# EAGLE design STorM32 NT imu v21 mini-mpu9250 (EAGLE 7.5.0)
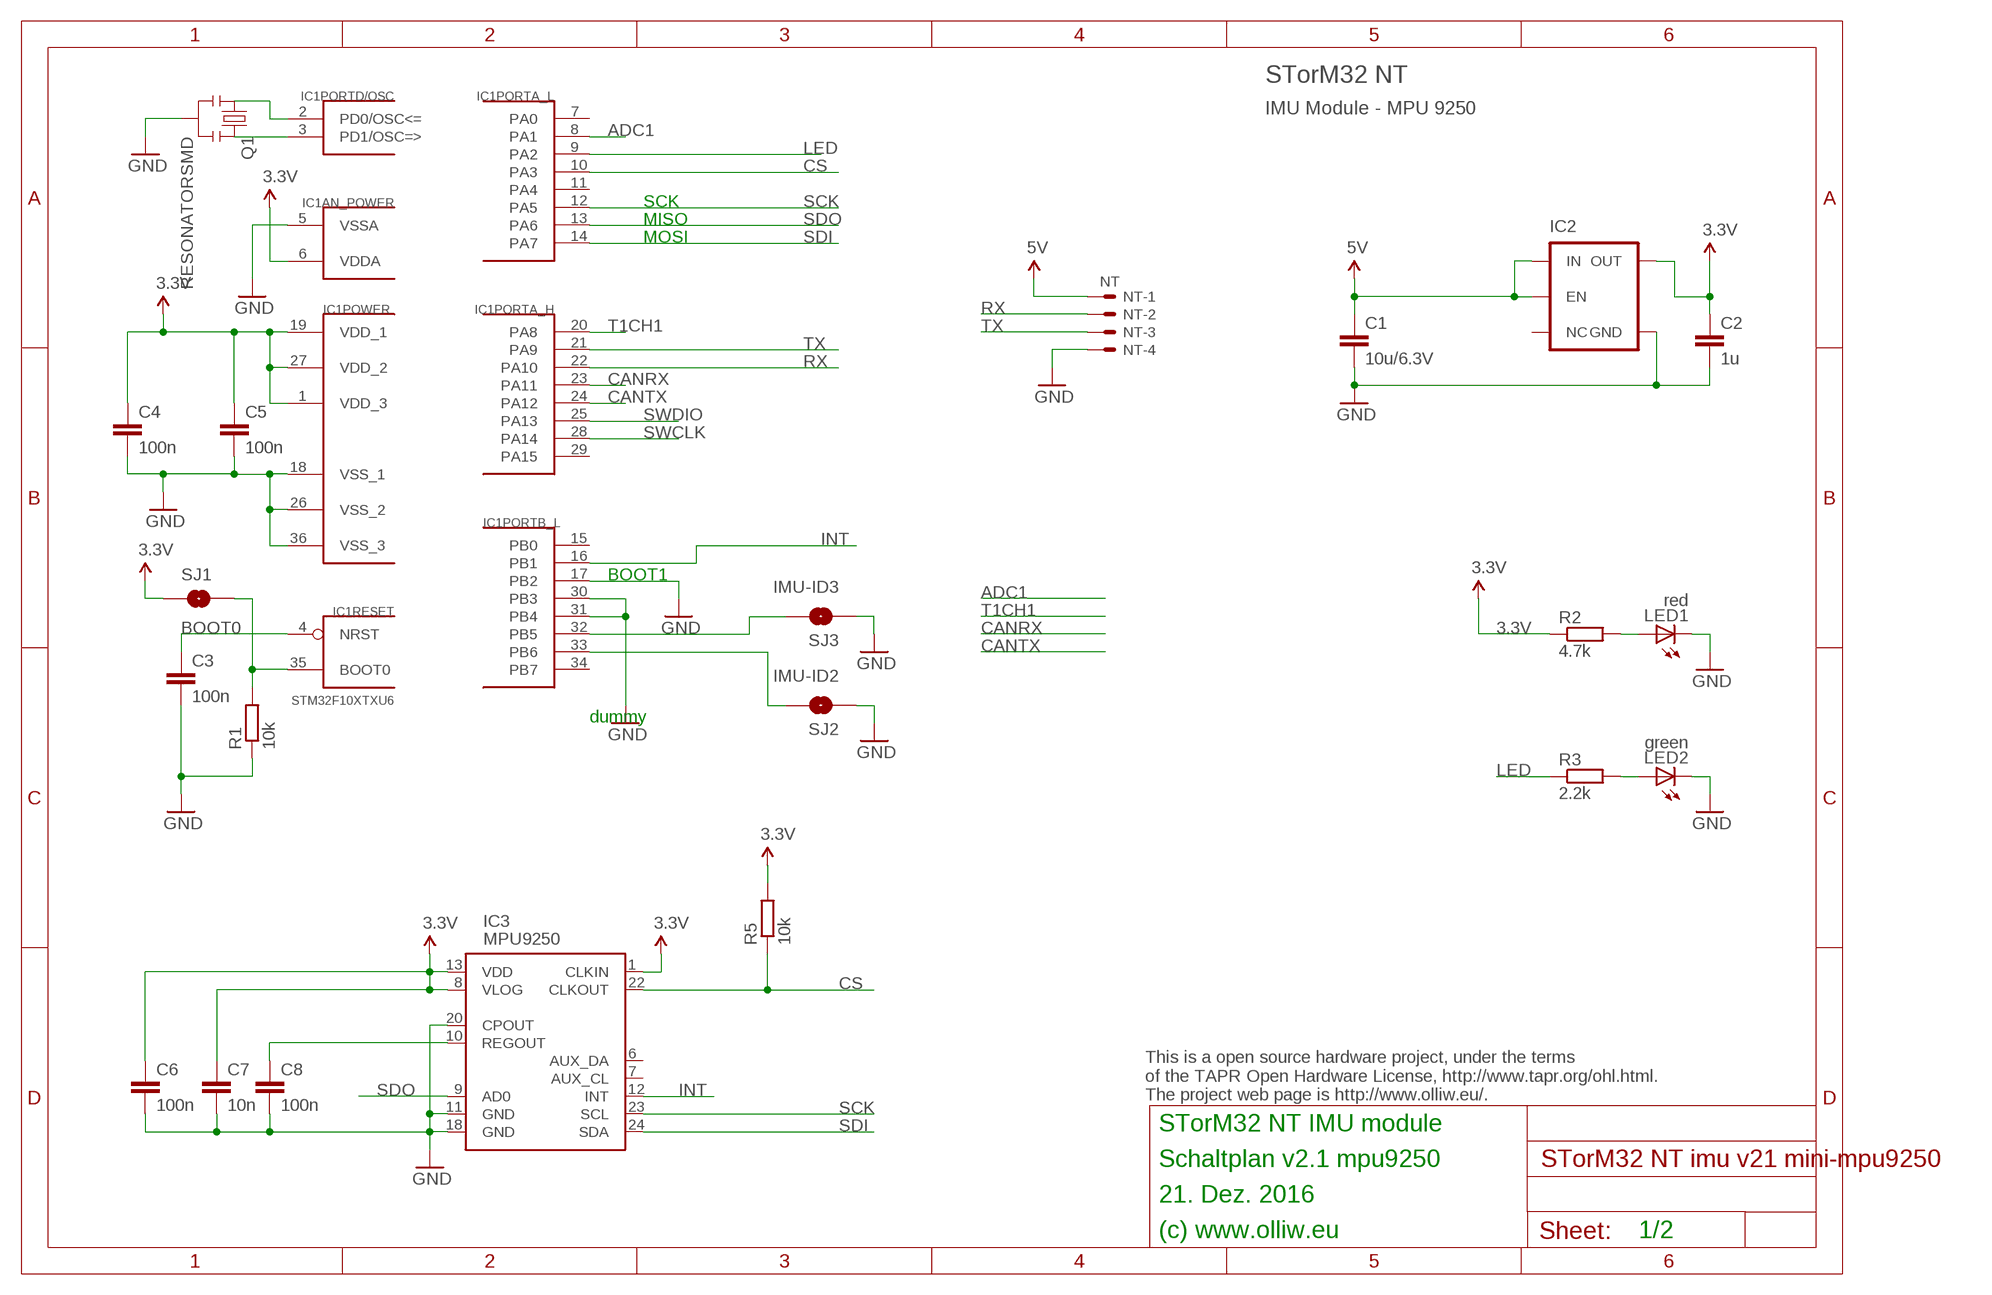
[diagram p0: schematic, sheet 1]

## Parts
C1  10u/6.3V  C-EUC0805  [C0805]
C2  1u  C-EUC0603  [C0603]
C3  100n  C-EUC0402  [C0402]
C4  100n  C-EUC0402  [C0402]
C5  100n  C-EUC0402  [C0402]
C6  100n  C-EUC0402  [C0402]
C7  10n  C-EUC0402  [C0402]
C8  100n  C-EUC0402  [C0402]
IC1  STM32F10XTXU6  [VFQFPN36]
IC2  V_REG_TPS76433SOT23-5  [SOT23-5]
IC3  MPU9250  IMU3000QFN-24-0.4MIL  [QFN-24-3X3]
LED1  red  LEDCHIPLED_0603  [CHIPLED_0603]
LED2  green  LEDCHIPLED_0603  [CHIPLED_0603]
NT  NT  SM04B-SRSS-TB  [SM04B-SRSS-TB]
Q1  RESONATORSMD  [RESONATOR-SMD]
R1  10k  R-EU_R0402  [R0402]
R2  4.7k  R-EU_R0402  [R0402]
R3  2.2k  R-EU_R0402  [R0402]
R5  10k  R-EU_R0402  [R0402]
SJ1  BOOT0  SOLDERJUMPERNO  [SJ_2S-NO]
SJ2  IMU-ID2  SOLDERJUMPERNO  [SJ_2S-NO]
SJ3  IMU-ID3  SOLDERJUMPERNO  [SJ_2S-NO]

## Nets
3.3V: C2.1 C4.1 C5.1 C6.1 C7.1 IC1.1(POWER:VDD_3) IC1.6(AN_POWER:VDDA) IC1.19(POWER:VDD_1) IC1.27(POWER:VDD_2) IC2.5(OUT) IC3.1(CLKIN) IC3.8(VLOG) IC3.13(VDD) R2.1 R5.2 SJ1.1
5V: C1.1 IC2.1(IN) IC2.3(EN) NT.1
ADC1: IC1.8(PORTA_L:PA1)
CANRX: IC1.23(PORTA_H:PA11)
CANTX: IC1.24(PORTA_H:PA12)
CS: IC1.10(PORTA_L:PA3) IC3.22(CLKOUT) R5.1
GND: C1.2 C2.2 C3.2 C4.2 C5.2 C6.2 C7.2 C8.2 IC1.5(AN_POWER:VSSA) IC1.17(PORTB_L:PB2) IC1.18(POWER:VSS_1) IC1.26(POWER:VSS_2) IC1.30(PORTB_L:PB3) IC1.31(PORTB_L:PB4) IC1.36(POWER:VSS_3) IC2.2(GND) IC3.11(GND) IC3.18(GND) IC3.20(CPOUT) LED1.C LED2.C NT.4 Q1.2 R1.1 SJ2.1 SJ3.1
INT: IC1.16(PORTB_L:PB1) IC3.12(INT)
LED: IC1.9(PORTA_L:PA2) R3.1
N$1: C3.1 IC1.4(RESET:NRST)
N$2: LED2.A R3.2
N$3: IC1.35(RESET:BOOT0) R1.2 SJ1.2
N$4: IC1.32(PORTB_L:PB5) SJ3.2
N$5: IC1.2(PORTD/OSC:PD0/OSC<=) Q1.1
N$6: IC1.3(PORTD/OSC:PD1/OSC=>) Q1.3
N$7: IC1.33(PORTB_L:PB6) SJ2.2
N$9: LED1.A R2.2
N$20: C8.1 IC3.10(REGOUT)
RX: IC1.22(PORTA_H:PA10) NT.2
SCK: IC1.12(PORTA_L:PA5) IC3.23(SCL)
SDI: IC1.14(PORTA_L:PA7) IC3.24(SDA)
SDO: IC1.13(PORTA_L:PA6) IC3.9(AD0)
SWCLK: IC1.28(PORTA_H:PA14)
SWDIO: IC1.25(PORTA_H:PA13)
T1CH1: IC1.20(PORTA_H:PA8)
TX: IC1.21(PORTA_H:PA9) NT.3
Unconnected: IC1.7(PORTA_L:PA0) IC1.11(PORTA_L:PA4) IC1.15(PORTB_L:PB0) IC1.29(PORTA_H:PA15) IC1.34(PORTB_L:PB7) IC2.4(NC) IC3.6(AUX_DA) IC3.7(AUX_CL)

## Notes on the sheet
- STorM32 NT
- IMU Module - MPU 9250
- SCK
- MISO
- MOSI
- BOOT1
- dummy
- This is a open source hardware project, under the terms
  of the TAPR Open Hardware License, http://www.tapr.org/ohl.html.
  The project web page is http://www.olliw.eu/.
- STorM32 NT IMU module
- Schaltplan v2.1 mpu9250
- 21. Dez. 2016
- (c) www.olliw.eu | 1/2

## Library data of the parts
C1-C8 = rcl:C-EU: CAPACITOR, European symbol
IC1 = # stm32:STM32F10XTXU6: STM32F101/103 36pad VFQPFN36
IC2 = # SparkFun2:V_REG_TPS76433: Voltage Regulator Older TI part. LDO 150mA regulator. No output by-pass cap option. See V_REG_LDO for a better part.
IC3 = # SparkFun2:IMU3000
LED1 LED2 = led:LED: LED OSRAM: - CHIPLED LG R971, LG N971, LY N971, LG Q971, LY Q971, LO R971, LY R971 LH N974, LH R974 LS Q976, LO Q976, LY Q976 LO Q996 - Hyper CHIPLED LW Q18S LB Q993, LB Q99A, LB R99A - SideLED LS A670, LO A670, LY A670, LG A670, LP A670 LB A673, LV A673, LT A673, LW A673 LH A674 LY A675 LS A676, LA A676, LO A676, LY A676, LW A676 LS A679, LY A679, LG A679 - Hyper Micro SIDELED® LS Y876, LA Y876, LO Y876, LY Y876 LT Y87S - SmartLED LW L88C, LW L88S LB L89C, LB L89S, LG L890 LS L89K, LO L89K, LY L89K LS L896, LA L896, LO L896, LY L896 - TOPLED LS T670, LO T670, LY T670, LG T670, LP T670 LSG T670, LSP T670, LSY T670, LOP T670, LYG T670 LG T671, LOG T671, LSG T671 LB T673, LV T673, LT T673, LW T673 LH T674 LS T676, LA T676, LO T676, LY T676, LB T676, LH T676, LSB T676, LW T676 LB T67C, LV T67C, LT T67C, LS T67K, LO T67K, LY T67K, LW E67C LS E67B, LA E67B, LO E67B, LY E67B, LB E67C, LV E67C, LT E67C LW T67C LS T679, LY T679, LG T679 LS T770, LO T770, LY T770, LG T770, LP T770 LB T773, LV T773, LT T773, LW T773 LH T774 LS E675, LA E675, LY E675, LS T675 LS T776, LA T776, LO T776, LY T776, LB T776 LHGB T686 LT T68C, LB T68C - Hyper Mini TOPLED® LB M676 - Mini TOPLED Santana® LG M470 LS M47K, LO M47K, LY M47K Source: http://www.osram.convergy.de LUXEON: - LUMILED® LXK2-PW12-R00, LXK2-PW12-S00, LXK2-PW14-U00, LXK2-PW14-V00 LXK2-PM12-R00, LXK2-PM12-S00, LXK2-PM14-U00 LXK2-PE12-Q00, LXK2-PE12-R00, LXK2-PE12-S00, LXK2-PE14-T00, LXK2-PE14-U00 LXK2-PB12-K00, LXK2-PB12-L00, LXK2-PB12-M00, LXK2-PB14-N00, LXK2-PB14-P00, LXK2-PB14-Q00 LXK2-PR12-L00, LXK2-PR12-M00, LXK2-PR14-Q00, LXK2-PR14-R00 LXK2-PD12-Q00, LXK2-PD12-R00, LXK2-PD12-S00 LXK2-PH12-R00, LXK2-PH12-S00 LXK2-PL12-P00, LXK2-PL12-Q00, LXK2-PL12-R00 Source: www.luxeon.com KINGBRIGHT: KA-3528ASYC Source: www.kingbright.com
NT = con-jst2:?M04B-SRSS-TB: Disconnectable Crimp style connector, 1.0mm pitch 4 contacts
Q1 = # SparkFun2:RESONATOR: Resonator Small SMD resonator. This is the itty bitty 10/20MHz resonators with built in caps. CSTCE10M0G55 and CSTCE20M0V53. Footprint has been reviewed closely but hasn't been tested yet.
R1-R3 R5 = rcl:R-EU_: RESISTOR, European symbol
SJ1-SJ3 = # SparkFun2:SOLDERJUMPER: Solder Jumper Standard SMD solder jumper. Used to automate production. Two varients : Normally Open and Normally Closed are the same, but have different paste layers. NC will have a large amount of paste and should jumper during reflow.

## Board
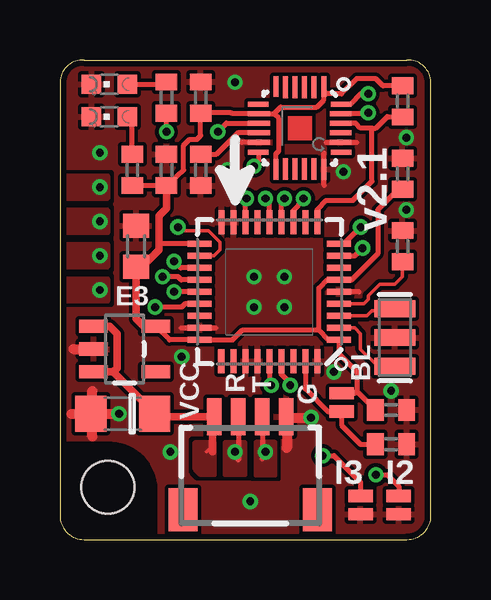
[diagram p1: board, top side]
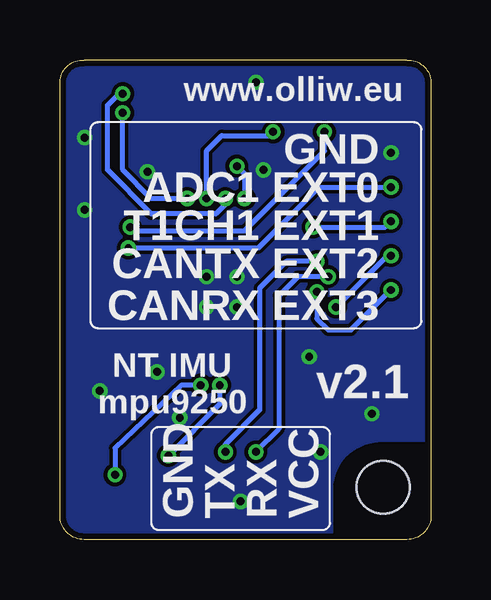
[diagram p2: board, bottom side, seen from below]

Size 15.48 x 19.98 mm. Coordinates in mm from the lower left corner, seen from the top.
Outline: 1,19.98 14.48,19.98 arc-90 15.48,19.06 15.48,1 arc-90 14.48,0 1,0 arc-90 0,1 0,19.06 arc-90 1,19.98
Copper layers (1*16): Top 0.035mm / dielectric 1.5mm / Bottom 0.035mm
Design rules "Fusion_eagle_rule_v1.1-shapes-supply-changed": minimum track width 6mil, minimum drill 12mil, track to track 6mil, track to pad 6mil, pad to pad 6mil, via to via 6mil, smd to smd 0mil, copper to edge 10mil, drill to drill 10mil, minimum pad ring 10mil, minimum via ring 6mil, stop-mask expansion 2mil, vias tented up to drill 100mil, thermal gap 6mil
Holes 2.2 mm at 2,2.17

### Footprints (pad centres in the part's own frame; a part is rotated, then mirrored left to right if it is on the bottom)
C0805 = smd 1.3 x 1.5: 1 -1.331,0; 2 1.331,0
C0603 = smd 1 x 1.1: 1 -0.85,0; 2 0.85,0
C0402 = smd 0.7 x 0.9: 1 -0.65,0; 2 0.65,0
VFQFPN36 = smd 1 x 0.25: 1 -2.9,2; 2 -2.9,1.5; 3 -2.9,1; 4 -2.9,0.5; 5 -2.9,0; 6 -2.9,-0.5; 7 -2.9,-1; 8 -2.9,-1.5; 9 -2.9,-2; 19 2.9,-2; 20 2.9,-1.5; 21 2.9,-1; 22 2.9,-0.5; 23 2.9,0; 24 2.9,0.5; 25 2.9,1; 26 2.9,1.5; 27 2.9,2 | smd 0.25 x 1: 10 -2,-2.9; 11 -1.5,-2.9; 12 -1,-2.9; 13 -0.5,-2.9; 14 0,-2.9; 15 0.5,-2.9; 16 1,-2.9; 17 1.5,-2.9; 18 2,-2.9; 29 1.5,2.9; 30 1,2.9; 31 0.5,2.9; 32 0,2.9; 33 -0.5,2.9; 34 -1,2.9; 35 -1.5,2.9; 36 -2,2.9 | smd 0.27 x 1: 28 2,2.9
SOT23-5 = smd 0.55 x 1.2: 1 -0.95,-1.3; 2 0,-1.3; 3 0.95,-1.3; 4 0.95,1.3; 5 -0.95,1.3
QFN-24-3X3 = smd 0.85 x 0.21: 1 -1.725,1; 6 -1.725,-1; 13 1.725,-1; 18 1.725,1 | smd 0.9 x 0.21: 2 -1.7,0.6; 3 -1.7,0.2; 5 -1.7,-0.6; 14 1.7,-0.6; 15 1.7,-0.2; 16 1.7,0.2; 17 1.7,0.6 | smd 0.9 x 0.2: 4 -1.7,-0.2 | smd 0.21 x 0.85: 7 -1,-1.725; 12 1,-1.725; 19 1,1.725; 24 -1,1.725 | smd 0.21 x 0.9: 8 -0.6,-1.7; 9 -0.2,-1.7; 10 0.2,-1.7; 11 0.6,-1.7; 20 0.6,1.7; 21 0.2,1.7; 22 -0.2,1.7; 23 -0.6,1.7
CHIPLED_0603 = smd 0.8 x 0.8: A 0,-0.75; C 0,0.75
SM04B-SRSS-TB = smd 0.6 x 1.55: 1 -1.5,2.975; 2 -0.5,2.975; 3 0.5,2.975; 4 1.5,2.975 | smd 1.2 x 1.8: FIT@1 -2.8,-0.9; FIT@2 2.8,-0.9
RESONATOR-SMD = smd 0.7 x 1.7: 1 -1.2,0; 2 0,0; 3 1.2,0
R0402 = smd 0.7 x 0.9: 1 -0.65,0; 2 0.65,0
SJ_2S-NO = smd 0.508 x 1.016: 1 -0.381,0; 2 0.381,0

### Placement (x,y rotation side)
C1  2.62,5.24 180 top
C2  3.17,12.22 90 top
C3  14.29,12.22 90 top
C4  14.29,15.24 90 top
C5  13.81,5.4 0 top
C6  4.45,15.4 90 top
C7  5.87,18.41 90 top
C8  5.87,15.4 270 top
IC1  8.73,10.32 180 top
IC2  2.7,7.94 270 top
IC3  10,17.14 270 top
LED1  2.06,17.62 90 top
LED2  2.06,18.97 90 top
NT  7.94,2.14 0 top
Q1  13.97,8.41 90 top
R1  13.81,3.97 180 top
R2  3.02,15.4 90 top
R3  4.45,18.41 90 top
R5  14.29,18.26 90 top
SJ1  11.75,5.71 270 top
SJ2  14.13,1.43 90 top
SJ3  12.54,1.43 90 top

### Tracks (layer width: path | path; a pad name or v marks a point on that pad's centre or on a via)
3.3V
  Top 0.203: R2.1 C6.1 4.45,14.76 5.16,15.4 5.16,16.43 5.4,16.67 5.71,16.67 5.87,16.83 C7.1 5.89,17.78 7.14,17.78 7.18,17.75 IC3.8 8.93,17.75 | IC1.19 4.19,12.32 4.13,12.38 | 8.93,17.75 9.21,18.02 10.72,18.02 11,18.3 IC3.1 11,18.68 11.11,18.57 11.75,18.57 12.38,19.21 13.18,19.21 13.48,18.91 R5.2 | 8.93,17.75 9.13,17.55 9.13,16.19 9,16.07 IC3.13 | C4.1 14.11,14.59 13.26,13.73 13.26,11.91 12.17,10.82 IC1.6 11.14,10.82 10.79,10.48 10.79,8.73 | 10.79,8.73 7.62,8.73 7.21,8.32 IC1.27 4.57,8.32 IC2.5 | 10.79,8.73 11.21,8.32 IC1.1 11.63,7.74 12.38,6.99 12.38,6.18 | 12.38,6.18 C5.1 | SJ1.1 12.3,6.1 12.38,6.18
  Top 0.305: IC2.5 3.5,8.89 3.17,9.21 C2.1 3.28,11.21 4.13,12.06 4.13,12.38 4.13,13.49 4.45,13.81 C6.1
5V
  Top 0.152: 6.11,3.65 6.43,3.97 6.36,3.66 | 4.07,5.12 C1.1
  Top 0.305: 3.53,5.12 C1.1 3.57,5.24 3.57,5.64 2.22,6.99 | IC2.3 2.22,6.99 | IC2.1 2.07,8.89 2.38,8.57 2.38,7.14 2.22,6.99 | 4.07,5.12 NT.1 6.39,5.12 6.35,5.08 6.36,3.66
  pour Top: 5.64,4.05 6.43,4.05 6.43,2.7 5.87,2.7 5.64,2.94
ADC1  (via drill 0.33)
  Top 0.203: IC1.8 12.29,11.82 v12.62,12.14
  Bottom 0.203: v1.67,14.68 4.68,14.68 7.22,12.14 v12.62,12.14
  pour Top: 0.16,15.16 1.98,15.16 1.98,14.21 0.16,14.21
CANRX  (via drill 0.33)
  Top 0.203: IC1.23 v4.76,10.32
  Bottom 0.203: v4.76,10.32 4.76,9.21 4.29,8.73 3.33,8.73 v1.67,10.4
  pour Top: 0.16,10.87 1.98,10.87 1.98,9.92 0.16,9.92
CANTX  (via drill 0.33)
  Top 0.203: IC1.24 5.21,9.82 5.08,9.68 v3.97,9.68
  Bottom 0.203: v3.97,9.68 1.83,11.83 v1.67,11.83
  pour Top: 0.16,12.3 1.98,12.3 1.98,11.35 0.16,11.35
CS
  Top 0.203: IC1.10 10.73,13.75 11.11,14.13 12.22,14.13 13.02,14.92 13.02,17.14 | 13.02,17.14 12.54,17.14 12.34,17.34 IC3.22 | 13.02,17.14 13.18,17.14 13.65,17.62 14.27,17.62 R5.1
GND  (via drill 0.33)
  Top 0.203: 11.11,16.55 12.38,16.55 | 11.02,14.76 11.02,16.11 | 8.54,16.55 7.59,16.55 | 12.48,10.32 11.29,10.32 | 6.5,8.8 5.07,8.8
  Top 0.406: 9.45,5.48 9.46,5.08 | 9.46,5.08 9.46,3.81 | 9.46,5.08 10.32,5.08 | 1.35,4.29 1.35,6.19 | 0.48,5.24 2.22,5.24 | 0.56,7.94 1.43,7.94
  other vias: 7.94,1.59 8.1,10.95 9.37,10.95 9.37,9.68 8.1,9.68 10.48,5.08 11.43,6.99 14.45,13.73 5.08,7.62 7.3,19.05 11.83,15.32 6.99,15.4 1.67,16.11 14.45,16.75 13.81,6.19 2.46,5.24 4.6,3.65
  pour Bottom (isolate 0.152): 0.17,19.22 arc-90 0.84,19.89 14.63,19.89 arc-90 15.31,19.22 15.31,1 arc-90 14.63,0.33 0.84,0.17 arc-90 0.17,0.84
  pour Top (isolate 0.152, rank 6): 0.17,19.22 arc-90 0.84,19.89 14.63,19.89 arc-90 15.31,19.22 15.31,0.84 arc-90 14.63,0.17 0.84,0.17 arc-90 0.17,0.84
  cutout Bottom: 4.06,0.25 4.06,2.1 arc90 2,4.06 0.25,4.06 0.25,1 arc90 1,0.25
  cutout Top: 4.06,0.25 4.06,2.1 arc90 2,4.06 0.25,4.06 0.25,1 arc90 1,0.25
INT  (via drill 0.33)
  Top 0.203: IC3.12 8.28,15.74 v8.1,15.56 | IC1.16 7.73,14.16 v7.78,14.21
  Bottom 0.203: v8.1,15.56 7.78,15.24 v7.78,14.21
LED  (via drill 0.33)
  Top 0.203: IC1.9 11.84,12.32 v12.54,13.02 | v4.45,16.99 R3.1
  Bottom 0.203: v12.54,13.02 12.38,12.86 7.78,12.86 4.45,16.19 v4.45,16.99
N$1
  Top 0.152: IC1.4 12.68,9.82 12.86,10 12.86,10.16 13.34,10.64 13.97,10.64 14.29,10.95 C3.1
N$2
  Top 0.203: LED2.A 4.43,18.97 R3.2
N$3
  Top 0.152: IC1.35
  Top 0.203: IC1.35 10.23,6.28 11.18,5.33 SJ1.2 11.75,4.76 12.54,3.97 R1.2
N$4  (via drill 0.33)
  Top 0.203: IC1.32 8.73,6.51 v8.81,6.43 | v10.95,3.49 11.43,3.49 12.54,2.38 SJ3.2
  Bottom 0.203: v8.81,6.43 8.81,5.64 v10.95,3.49
N$5
  Top 0.152: IC1.2 12.29,8.82 12.54,8.57 12.54,7.94 13.18,7.3 13.88,7.3 Q1.1
N$6
  Top 0.152: IC1.3 12.81,9.32 13.02,9.53 14.13,9.53 14.04,9.61 Q1.3
N$7  (via drill 0.33)
  Top 0.203: IC1.33 9.23,6.88 9.6,6.51 v9.6,6.43 | v13.18,2.7 13.65,2.7 14.13,2.22 SJ2.2
  Bottom 0.203: v9.6,6.43 10.4,6.43 13.18,3.81 v13.18,2.7
N$9
  Top 0.203: R2.2 3.02,17.58 LED1.A
N$20
  Top 0.203: IC3.10 7.42,16.95 6.51,16.03 5.89,16.03 C8.1
RX  (via drill 0.33)
  Top 0.203: IC1.22 5.06,10.82 4.92,10.95 v4.29,10.95 | NT.2 7.44,3.31 v7.3,3.65
  Bottom 0.203: v4.29,10.95 5.56,10.95 6.35,10.16 6.35,4.6 v7.3,3.65
  pour Top: 6.91,4.05 7.7,4.05 7.7,2.7 6.91,2.7
SCK  (via drill 0.33)
  Top 0.203: v12.86,17.78 12.82,17.75 IC3.23 | IC1.12 9.73,13.7 10.16,14.13 v10.16,14.21
  Bottom 0.203: v10.16,14.21 11.67,14.21 12.86,15.4 v12.86,17.78
SDI  (via drill 0.33)
  Top 0.203: IC1.14 8.73,14.05 v8.57,14.21 | v12.86,18.57 12.54,18.57 12.11,18.14 IC3.24
  Bottom 0.203: v8.57,14.21 8.57,13.97 8.97,13.57 11.67,13.57 13.49,15.4 13.49,18.1 13.02,18.57 v12.86,18.57
SDO  (via drill 0.33)
  Top 0.203: v6.59,16.99 6.95,17.34 IC3.9 | IC1.13 9.23,14.07 v9.37,14.21
  Bottom 0.203: v9.37,14.21 9.37,16.19 8.73,16.83 6.75,16.83 v6.59,16.99
T1CH1  (via drill 0.33)
  Top 0.152: IC1.20 6.42,11.82 6.67,12.06 6.67,12.38 6.19,12.86 5.08,12.86 v4.92,13.02
  Bottom 0.203: v4.92,13.02 1.91,13.02 v1.67,13.26
  pour Top: 0.16,13.73 1.98,13.73 1.98,12.78 0.16,12.78
TX  (via drill 0.33)
  Top 0.203: IC1.21 5.03,11.32 v4.76,11.59 | NT.3 8.44,3.36 v8.57,3.65
  Bottom 0.203: v4.76,11.59 6.03,11.59 7.14,10.48 7.14,5.4 8.57,3.97 v8.57,3.65
  pour Top: 8.18,4.05 8.18,2.7 8.97,2.7 8.97,4.05

### Text on the board
tNames: v2.1 | E3 | BL | R | T | G | VCC | I3 | I2
bNames: www.olliw.eu | GND | ADC1 EXT0 | T1CH1 EXT1 | CANTX EXT2 | CANRX EXT3 | NT IMU / mpu9250 | v2.1 | VCC | RX | TX | GND